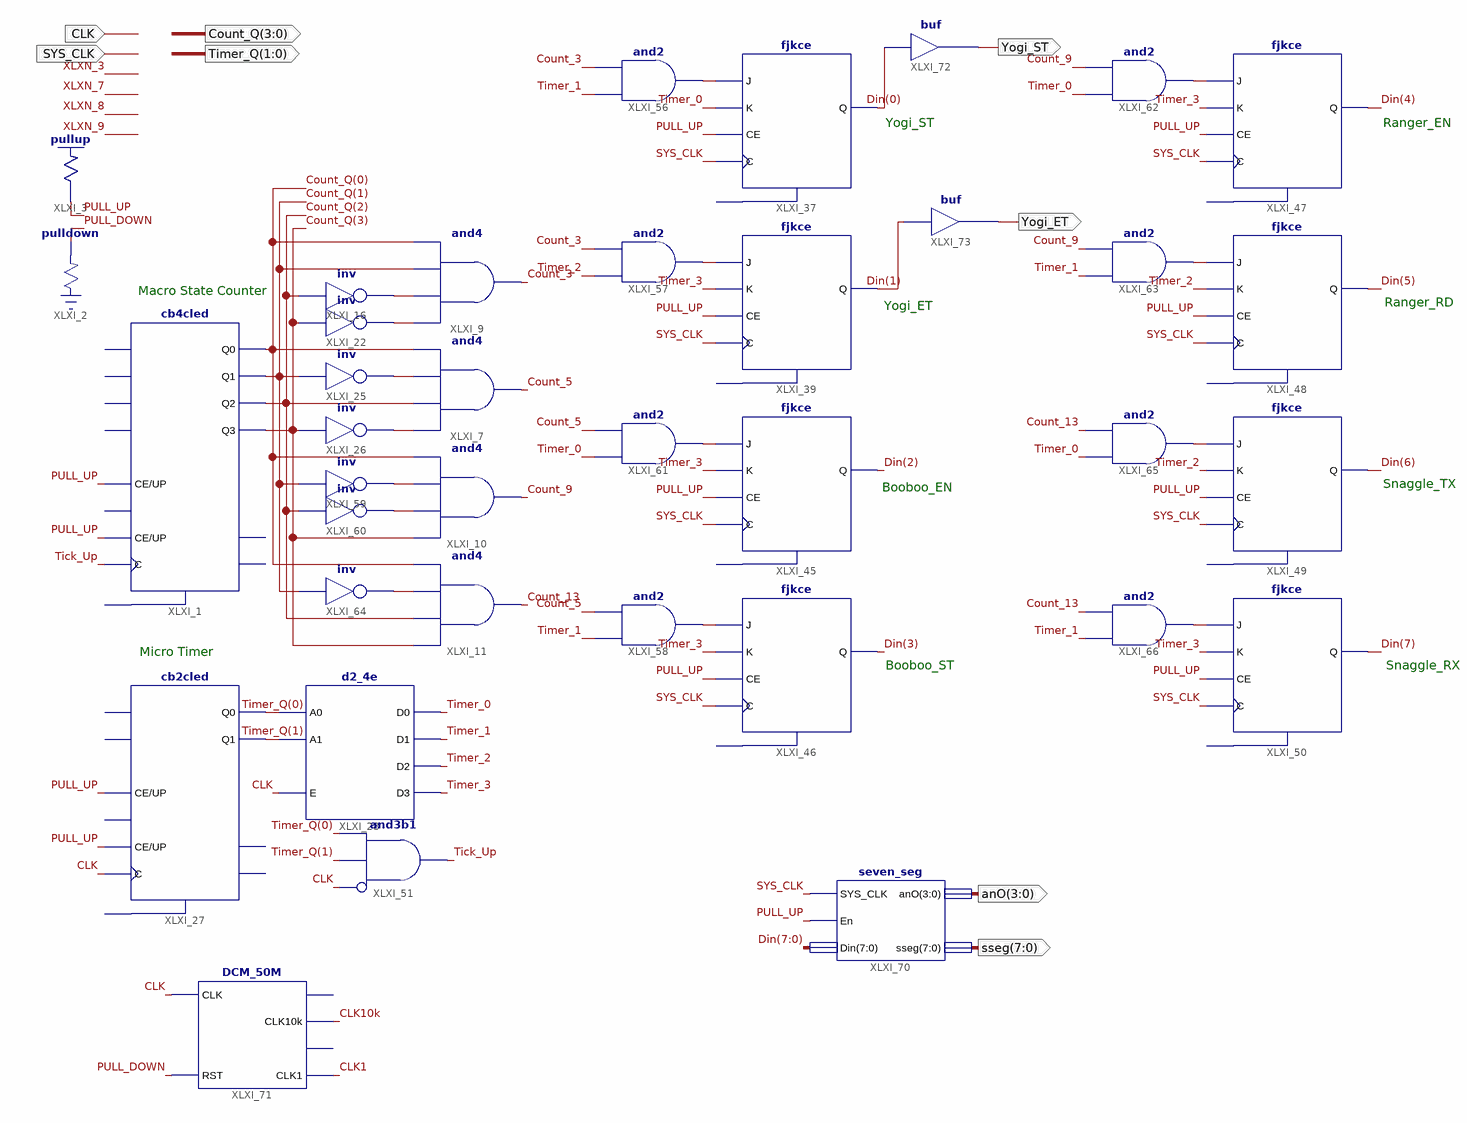
[diagram p0: schematic sheet 1]
// Xilinx ISE schematic Lab9_Ex3.sch (spartan3e) as structural Verilog: 37 symbols, 8 ports
module Lab9_Ex3 (
  input  CLK,
  input  SYS_CLK,
  output [1:0] Timer_Q,
  output [3:0] Count_Q,
  output [7:0] sseg,
  output [3:0] anO,
  output Yogi_ST,
  output Yogi_ET
);

  wire Booboo_EN_J, CLK1, CLK10k, Count_3, Count_5, Count_9, Count_13, PULL_DOWN, PULL_UP, Tick_Up, Timer_0,
       Timer_1, Timer_2, Timer_3, XLXN_60, XLXN_61, XLXN_81, XLXN_82, XLXN_131, XLXN_136, XLXN_144, XLXN_148,
       XLXN_152, XLXN_156, XLXN_160, XLXN_178, XLXN_179, XLXN_184;
  wire [7:0] Din;

  \pullup  XLXI_3 (.O(PULL_UP));
  cb4cled XLXI_1 (
    .C(Tick_Up), .CE(PULL_UP), .UP(PULL_UP), .Q0(Count_Q[0]), .Q1(Count_Q[1]), .Q2(Count_Q[2]),
    .Q3(Count_Q[3]));  // open: CLR, D0, D1, D2, D3, L, CEO, TC
  \pulldown  XLXI_2 (.O(PULL_DOWN));
  and XLXI_7 (Count_5, XLXN_60, Count_Q[2], XLXN_61, Count_Q[0]);
  and XLXI_9 (Count_3, XLXN_82, XLXN_81, Count_Q[1], Count_Q[0]);
  and XLXI_10 (Count_9, Count_Q[3], XLXN_178, XLXN_179, Count_Q[0]);
  and XLXI_11 (Count_13, Count_Q[3], Count_Q[2], XLXN_184, Count_Q[0]);
  not XLXI_22 (XLXN_82, Count_Q[3]);
  not XLXI_16 (XLXN_81, Count_Q[2]);
  not XLXI_25 (XLXN_61, Count_Q[1]);
  not XLXI_26 (XLXN_60, Count_Q[3]);
  cb2cled XLXI_27 (
    .C(CLK), .CE(PULL_UP), .UP(PULL_UP), .Q0(Timer_Q[0]), .Q1(Timer_Q[1]));  // open: CLR, D0, D1, L, CEO, TC
  d2_4e XLXI_28 (.A0(Timer_Q[0]), .A1(Timer_Q[1]), .E(CLK), .D0(Timer_0), .D1(Timer_1), .D2(Timer_2), .D3(Timer_3));
  fjkce XLXI_39 (.C(SYS_CLK), .CE(PULL_UP), .J(XLXN_136), .K(Timer_3), .Q(Din[1]));  // open: CLR
  fjkce XLXI_37 (.C(SYS_CLK), .CE(PULL_UP), .J(XLXN_131), .K(Timer_0), .Q(Din[0]));  // open: CLR
  fjkce XLXI_45 (.C(SYS_CLK), .CE(PULL_UP), .J(Booboo_EN_J), .K(Timer_3), .Q(Din[2]));  // open: CLR
  fjkce XLXI_46 (.C(SYS_CLK), .CE(PULL_UP), .J(XLXN_144), .K(Timer_3), .Q(Din[3]));  // open: CLR
  fjkce XLXI_47 (.C(SYS_CLK), .CE(PULL_UP), .J(XLXN_160), .K(Timer_3), .Q(Din[4]));  // open: CLR
  and XLXI_51 (Tick_Up, ~CLK, Timer_Q[1], Timer_Q[0]);  // and3b1
  and XLXI_56 (XLXN_131, Timer_1, Count_3);
  and XLXI_57 (XLXN_136, Timer_2, Count_3);
  and XLXI_58 (XLXN_144, Timer_1, Count_5);
  not XLXI_59 (XLXN_179, Count_Q[1]);
  not XLXI_60 (XLXN_178, Count_Q[2]);
  and XLXI_61 (Booboo_EN_J, Timer_0, Count_5);
  and XLXI_62 (XLXN_160, Timer_0, Count_9);
  and XLXI_63 (XLXN_156, Timer_1, Count_9);
  not XLXI_64 (XLXN_184, Count_Q[1]);
  and XLXI_65 (XLXN_152, Timer_0, Count_13);
  and XLXI_66 (XLXN_148, Timer_1, Count_13);
  fjkce XLXI_49 (.C(SYS_CLK), .CE(PULL_UP), .J(XLXN_152), .K(Timer_2), .Q(Din[6]));  // open: CLR
  fjkce XLXI_50 (.C(SYS_CLK), .CE(PULL_UP), .J(XLXN_148), .K(Timer_3), .Q(Din[7]));  // open: CLR
  fjkce XLXI_48 (.C(SYS_CLK), .CE(PULL_UP), .J(XLXN_156), .K(Timer_2), .Q(Din[5]));  // open: CLR
  seven_seg XLXI_70 (.SYS_CLK(SYS_CLK), .En(PULL_UP), .Din(Din), .anO(anO), .sseg(sseg));
  DCM_50M XLXI_71 (.CLK(CLK), .RST(PULL_DOWN), .CLK10k(CLK10k), .CLK1(CLK1));  // open: CLK1M, CLK1k
  buf XLXI_72 (Yogi_ST, Din[0]);
  buf XLXI_73 (Yogi_ET, Din[1]);

  // Notes on the sheet:
  //   Yogi_ST
  //   Ranger_EN
  //   Macro State Counter
  //   Ranger_RD
  //   Yogi_ET
  //   Snaggle_TX
  //   Booboo_EN
  //   Micro Timer
  //   Booboo_ST
  //   Snaggle_RX
endmodule
